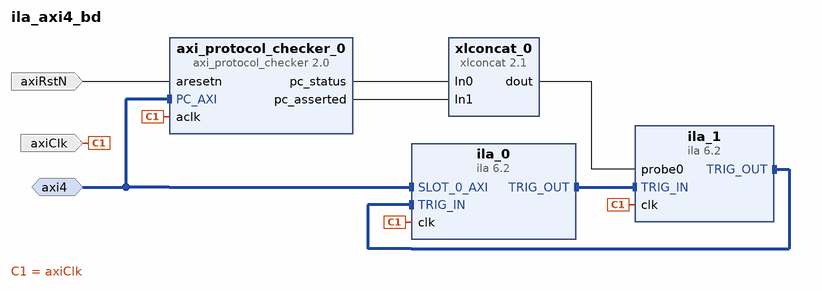
[diagram p0: block diagram of the top level]
# Vivado block design ila_axi4_bd, xc7z010clg400-1, Vivado 2018.3
create_bd_design ila_axi4_bd

create_bd_intf_port -mode Monitor -vlnv xilinx.com:interface:aximm_rtl:1.0 axi4
set_property -dict [list \
  CONFIG.ADDR_WIDTH 32 \
  CONFIG.DATA_WIDTH 32 \
  CONFIG.FREQ_HZ 156000000 \
  CONFIG.ID_WIDTH 0 \
  CONFIG.PROTOCOL AXI4 \
] [get_bd_intf_ports axi4]
create_bd_port -dir I -type clk axiClk
set_property -dict {CONFIG.ASSOCIATED_BUSIF axi4:axi4 CONFIG.FREQ_HZ 156000000} [get_bd_ports axiClk]
create_bd_port -dir I -type rst axiRstN
set_property -dict {CONFIG.POLARITY ACTIVE_LOW} [get_bd_ports axiRstN]

create_bd_cell -type ip -vlnv xilinx.com:ip:ila:6.2 ila_0
set_property -dict [list \
  CONFIG.C_ENABLE_ILA_AXI_MON true \
  CONFIG.C_MONITOR_TYPE AXI \
  CONFIG.C_NUM_OF_PROBES 44 \
  CONFIG.C_TRIGIN_EN true \
  CONFIG.C_TRIGOUT_EN true \
] [get_bd_cells ila_0]
create_bd_cell -type ip -vlnv xilinx.com:ip:axi_protocol_checker:2.0 axi_protocol_checker_0
create_bd_cell -type ip -vlnv xilinx.com:ip:ila:6.2 ila_1
set_property -dict [list \
  CONFIG.C_ENABLE_ILA_AXI_MON false \
  CONFIG.C_MONITOR_TYPE Native \
  CONFIG.C_NUM_OF_PROBES 1 \
  CONFIG.C_PROBE0_WIDTH 161 \
  CONFIG.C_TRIGIN_EN true \
  CONFIG.C_TRIGOUT_EN true \
] [get_bd_cells ila_1]
create_bd_cell -type ip -vlnv xilinx.com:ip:xlconcat:2.1 xlconcat_0
set_property -dict {CONFIG.IN0_WIDTH 160} [get_bd_cells xlconcat_0]

# ---- connections ----

connect_bd_intf_net [get_bd_intf_pins ila_0/TRIG_OUT] [get_bd_intf_pins ila_1/TRIG_IN]
connect_bd_intf_net [get_bd_intf_pins ila_0/TRIG_IN] [get_bd_intf_pins ila_1/TRIG_OUT]
connect_bd_intf_net [get_bd_intf_pins ila_0/SLOT_0_AXI] [get_bd_intf_pins axi_protocol_checker_0/PC_AXI]
connect_bd_intf_net [get_bd_intf_pins ila_0/SLOT_0_AXI] [get_bd_intf_ports axi4]
connect_bd_net [get_bd_ports axiClk] [get_bd_pins ila_0/clk] [get_bd_pins axi_protocol_checker_0/aclk] [get_bd_pins ila_1/clk]
connect_bd_net [get_bd_pins axi_protocol_checker_0/pc_status] [get_bd_pins xlconcat_0/In0]
connect_bd_net [get_bd_pins axi_protocol_checker_0/pc_asserted] [get_bd_pins xlconcat_0/In1]
connect_bd_net [get_bd_pins xlconcat_0/dout] [get_bd_pins ila_1/probe0]
connect_bd_net -net aResetN_1 [get_bd_ports axiRstN] [get_bd_pins axi_protocol_checker_0/aresetn]

validate_bd_design
save_bd_design
